# Altium schematic sheet Data_adalogger.SchDoc
size A3; SheetNumber: 2; SheetTotal: 2
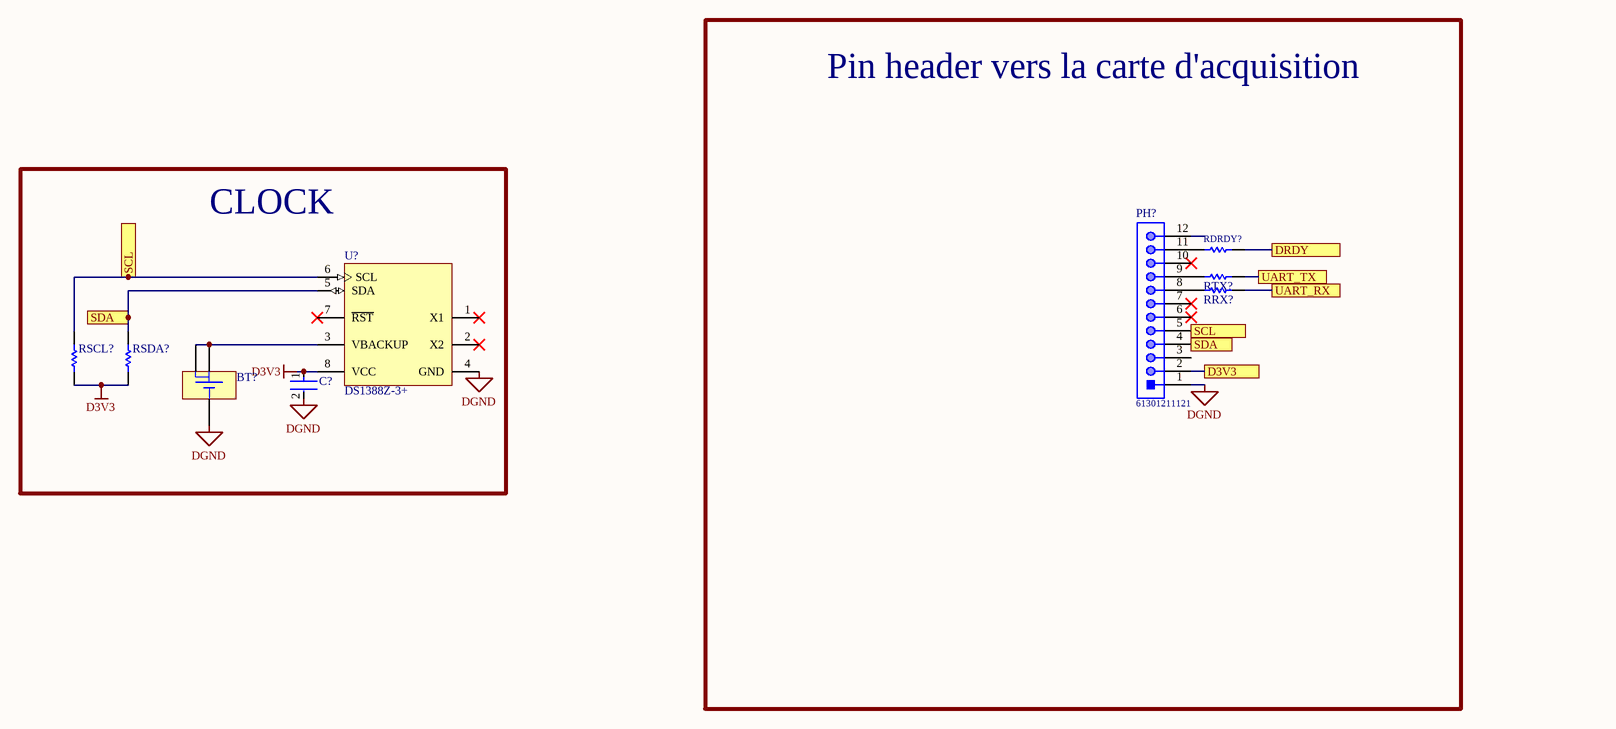
[diagram p0: Data_adalogger.SchDoc]

## Parts
BT?  BAT-HLD-001  [BATHLD-001]  (value not drawn)
C?  C0805C104K5RACTU  [FP-C0805C-DN-MFG]  (value not drawn)
PH?  61301211121  [61301211121]
RDRDY?  ERA6AEB473V  [RESC2013X60X40ML20T25]  (value not drawn)
RRX?  ERA6AEB473V  [RESC2013X60X40ML20T25]  (value not drawn)
RSCL?  RC0805FR-074K7L  [YAGO-RC0805_M]  (value not drawn)
RSDA?  RC0805FR-074K7L  [YAGO-RC0805_M]  (value not drawn)
RTX?  ERA6AEB473V  [RESC2013X60X40ML20T25]  (value not drawn)
U?  DS1388Z-3+  [S8+4_L]

## Blocks framed on the sheet
Pin header vers la carte d'acquisition: PH? RDRDY? RRX? RTX?
CLOCK: BT? C? RSCL? RSDA? U?

## Ports
D3V3, DRDY, SCL, SDA, UART_RX, UART_TX

## Nets
D3V3: C?.1 RSCL?.1 RSDA?.1 U?.8(VCC)
DGND: BT?.1(-) C?.2 PH?.1 U?.4(GND)
D3V3: PH?.2 ; port D3V3  [a separate net that carries the same name]
DRDY: RDRDY?.2 ; port DRDY
SCL: PH?.5 RSCL?.2 U?.6(SCL) ; port SCL
SDA: PH?.4 RSDA?.2 U?.5(SDA) ; port SDA
UART_RX: RRX?.2 ; port UART_RX
UART_TX: RTX?.2 ; port UART_TX
NetBT?_2: BT?.2(+) BT?.3(+) U?.3(VBACKUP)
NetPH?_8: PH?.8 RRX?.1
NetPH?_9: PH?.9 RTX?.1
NetPH?_11: PH?.11 RDRDY?.1

Not connected (* = marked no-connect by the designer): PH? 3 6* 7* 10* 12; U? 1(X1)* 2(X2)* 7(~{RST})*

## Library data of the parts
BT? = CMP-0168-00043-1: 20mm Coin Cell Battery Holder; PCB_Layout: Complies with manufacturer's recommendation.; DatasheetVersion: rev1.0, Dec-2007; PackageVersion: rev1.0, Dec-2007; PackageReference: BATHLD-001; PackageDescription: Low Profile SM Battery Holder, 20mm Lithium Cell, 21.1 x 15.3 x 4.2 mm Body
C? = CMP-2007-00279-2: CAP CER 0.1UF 50V X7R 0805; Manufacturer: KEMET; Value: 0.10 μF; Tolerance: 0.1; Temperature Coefficient: 30ppm/°C; Material: Ceramic; Manufacturer Part Number: C0805C104K5RACTU; Device Class L2: Capacitors; Temperature Range Low: -55°C; Voltage Rating: 50 V; Digikey Description: CAP CER 0.1UF 50V X7R 0805; Category: Cap; ComponentLink2Description: Datasheet; Octopart: https://octopart.com/c0805c104k5ractu-kemet-143926; RoHS: TRUE; ComponentLink2URL: https://content.kemet.com/datasheets/KEM_C1003_C0G_SMD.pdf; Temperature Characteristic: X7R; Temperature: -55°C to +125°C; Height: 0.88mm; Temperature Range High: +125°C; Device Class L1: Passive Components; Automotive: No; Lead Free: Yes; Ipc Land Pattern Name: CAPC200125X78; Device Class L3: Ceramic Capacitors; Mouser Description: Cap Ceramic 0.1uF 50V X7R 10% SMD 2.0 x 1.2 mm 125 C Paper T/R; Capacitance: 0.10 μF; Package: C0805C-DN
PH? = CMP-1502-01086-1: THT Vertical Pin Header WR-PHD, Pitch 2.54 mm, Single Row, 12 pins; Manufacturer: Wurth Elektronik; Pin Number: 12; Gender: Male; Working Voltage: 250VAC; Rated Current: 3A; Withstanding Voltage: 500VAC; Pitch: 2.54mm; Contact Resistance: 20mOhm; Orientation: Vertical; Package Reference: 61301211121; Packaging: Bag; Operating Temperature: -40to105degC; Mounting Technology: THT; Part Number: 61301211121; Manufacturer URL: http://www.we-online.de; Row Number: Single; Publisher: WurthElektronik; Datasheet URL: https://katalog.we-online.de/em/datasheet/6130xx11121.pdf
RDRDY? RRX? RTX? = CMP-2001-00645-1: Manufacturer: Panasonic; Part Number: ERA6AEB473V
RSCL? RSDA? = CMP-1568-00001-1: General Puprose Chip Resistor, 4700 Ohm +/- 1%, 0.125 W, -55 to 155 degC, 2-Pin SMD, RoHS, Tape and Reel; Tolerance: +/- 1%; Power: 0.125 W; PackageDescription: 2-Pin Surface Mount Device, Body 2 x 1.25 mm; ComponentLink2URL: http://www.yageo.com/documents/recent/PYu-RC_Group_51_RoHS_L-3.pdf; Temperature Min: -55 degC; Packing: Tape and Reel; Mounting Technology: Surface Mount; PartNumber: RC0805FR-074K7L; ComponentLink1URL: http://www.yageo.com/NewPortal/_en/index.jsp; Resistance: 4700 Ohm; Temperature Max: 155 degC; ComponentLink2Description: Datasheet; DatasheetVersion: Rev. 3; RoHS: TRUE; ComponentLink1Description: Manufacturer URL
U? = CMP-0254-00378-1: I2C Real-Time Clock/Supervisor with Trickle Charger and 512 Byte EEPROM, 3.0V, 8-Pin SO, -40 to 85 degC, Pb-Free; Code_JEDEC: MS-012-AA; DatasheetVersion: rev3, Aug-2010; ComponentLink3URL: http://pdfserv.maxim-ic.com/package_dwgs/21-0041.PDF; ComponentLink1Description: Manufacturer URL; ComponentLink1URL: http://www.maxim-ic.com; PackageDescription: 8-Pin Small-Outline IC, Narrow (0.15in), 1.27 mm Pitch, SOIC (N), Pb-Free; ComponentLink2URL: http://datasheets.maxim-ic.com/en/ds/DS1388.pdf; Code_IPC: SOIC127P600-8; PackageVersion: revC, 2010; PackageReference: S8+4; ComponentLink2Description: Datasheet; ComponentLink3Description: Package Specification